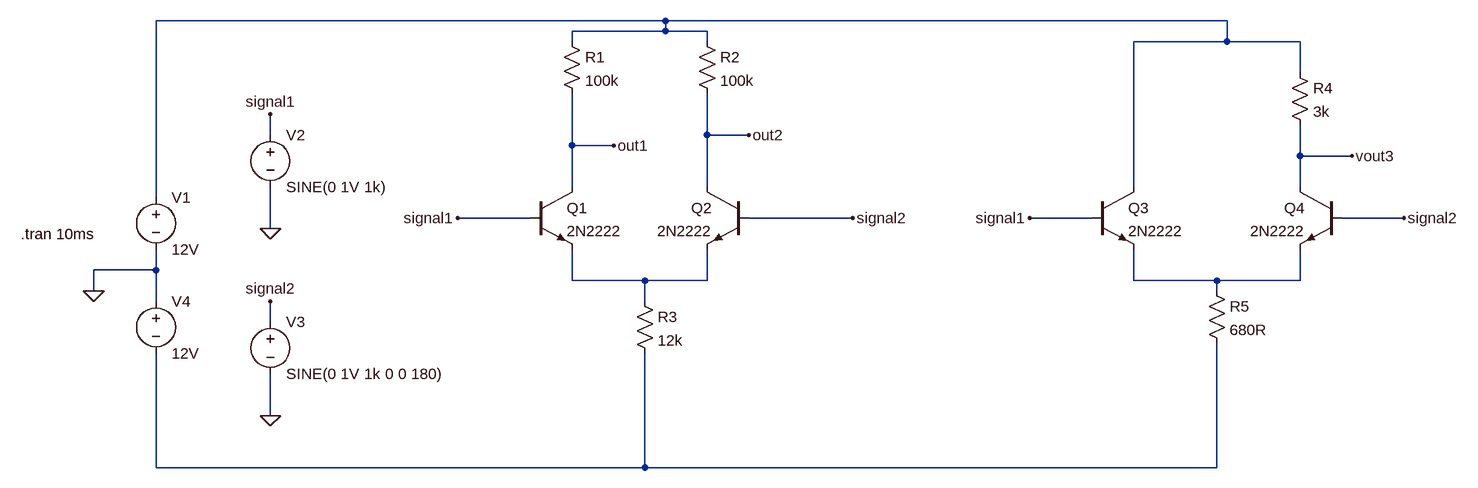
[diagram p0: schematic amplificador-doferencial.asc]
amplificador-doferencial.asc, the LTspice schematic file:
Version 4
SHEET 1 1492 680
WIRE 256 -128 -528 -128
WIRE 1120 -128 256 -128
WIRE 256 -112 256 -128
WIRE 256 -112 112 -112
WIRE 320 -112 256 -112
WIRE 112 -96 112 -112
WIRE 320 -96 320 -112
WIRE 1120 -96 1120 -128
WIRE 1120 -96 976 -96
WIRE 1232 -96 1120 -96
WIRE 1232 -48 1232 -96
WIRE -352 48 -352 16
WIRE 320 48 320 -16
WIRE 384 48 320 48
WIRE 112 64 112 -16
WIRE 176 64 112 64
WIRE 1232 80 1232 32
WIRE 1312 80 1232 80
WIRE 112 128 112 64
WIRE 320 128 320 48
WIRE 976 128 976 -96
WIRE 1232 128 1232 80
WIRE -528 144 -528 -128
WIRE 48 176 -64 176
WIRE 544 176 384 176
WIRE 912 176 816 176
WIRE 1392 176 1296 176
WIRE -352 192 -352 128
WIRE -528 256 -528 224
WIRE -528 256 -624 256
WIRE 112 272 112 224
WIRE 224 272 112 272
WIRE 320 272 320 224
WIRE 320 272 224 272
WIRE 976 272 976 224
WIRE 1104 272 976 272
WIRE 1232 272 1232 224
WIRE 1232 272 1104 272
WIRE -624 288 -624 256
WIRE 1104 288 1104 272
WIRE -528 304 -528 256
WIRE 224 304 224 272
WIRE -352 336 -352 304
WIRE -352 480 -352 416
WIRE -528 560 -528 384
WIRE 224 560 224 384
WIRE 224 560 -528 560
WIRE 1104 560 1104 368
WIRE 1104 560 224 560
FLAG -352 192 0
FLAG -352 480 0
FLAG -352 16 signal1
FLAG -64 176 signal1
FLAG -352 304 signal2
FLAG 544 176 signal2
FLAG 176 64 out1
FLAG 384 48 out2
FLAG 816 176 signal1
FLAG 1392 176 signal2
FLAG 1312 80 vout3
FLAG -624 288 0
SYMBOL npn 48 128 R0
SYMATTR InstName Q1
SYMATTR Value 2N2222
SYMBOL npn 384 128 M0
SYMATTR InstName Q2
SYMATTR Value 2N2222
SYMBOL res 96 -112 R0
SYMATTR InstName R1
SYMATTR Value 100k
SYMBOL res 304 -112 R0
SYMATTR InstName R2
SYMATTR Value 100k
SYMBOL res 208 288 R0
SYMATTR InstName R3
SYMATTR Value 12k
SYMBOL voltage -528 128 R0
WINDOW 123 0 0 Left 0
WINDOW 39 0 0 Left 0
SYMATTR InstName V1
SYMATTR Value 12V
SYMBOL voltage -352 32 R0
WINDOW 123 0 0 Left 0
WINDOW 39 0 0 Left 0
SYMATTR InstName V2
SYMATTR Value SINE(0 1V 1k)
SYMBOL voltage -352 320 R0
WINDOW 123 0 0 Left 0
WINDOW 39 0 0 Left 0
SYMATTR InstName V3
SYMATTR Value SINE(0 1V 1k 0 0 180)
SYMBOL npn 912 128 R0
SYMATTR InstName Q3
SYMATTR Value 2N2222
SYMBOL npn 1296 128 M0
SYMATTR InstName Q4
SYMATTR Value 2N2222
SYMBOL res 1216 -64 R0
SYMATTR InstName R4
SYMATTR Value 3k
SYMBOL res 1088 272 R0
SYMATTR InstName R5
SYMATTR Value 680R
SYMBOL voltage -528 288 R0
WINDOW 123 0 0 Left 0
WINDOW 39 0 0 Left 0
SYMATTR InstName V4
SYMATTR Value 12V
TEXT -736 200 Left 2 !.tran 10ms

The netlist it stands for:
* amplificador-doferencial.asc
Q1 out1 signal1 N002 0 2N2222
Q2 out2 signal2 N002 0 2N2222
R1 N001 out1 100k
R2 N001 out2 100k
R3 N002 N004 12k
V1 N001 0 12V
V2 signal1 0 SINE(0 1V 1k)
V3 signal2 0 SINE(0 1V 1k 0 0 180)
Q3 N001 signal1 N003 0 2N2222
Q4 vout3 signal2 N003 0 2N2222
R4 N001 vout3 3k
R5 N003 N004 680R
V4 0 N004 12V
.model NPN NPN
.model PNP PNP
.lib standard.bjt
.tran 10ms
.backanno
.end